# Altium schematic sheet VW.SchDoc
size A3
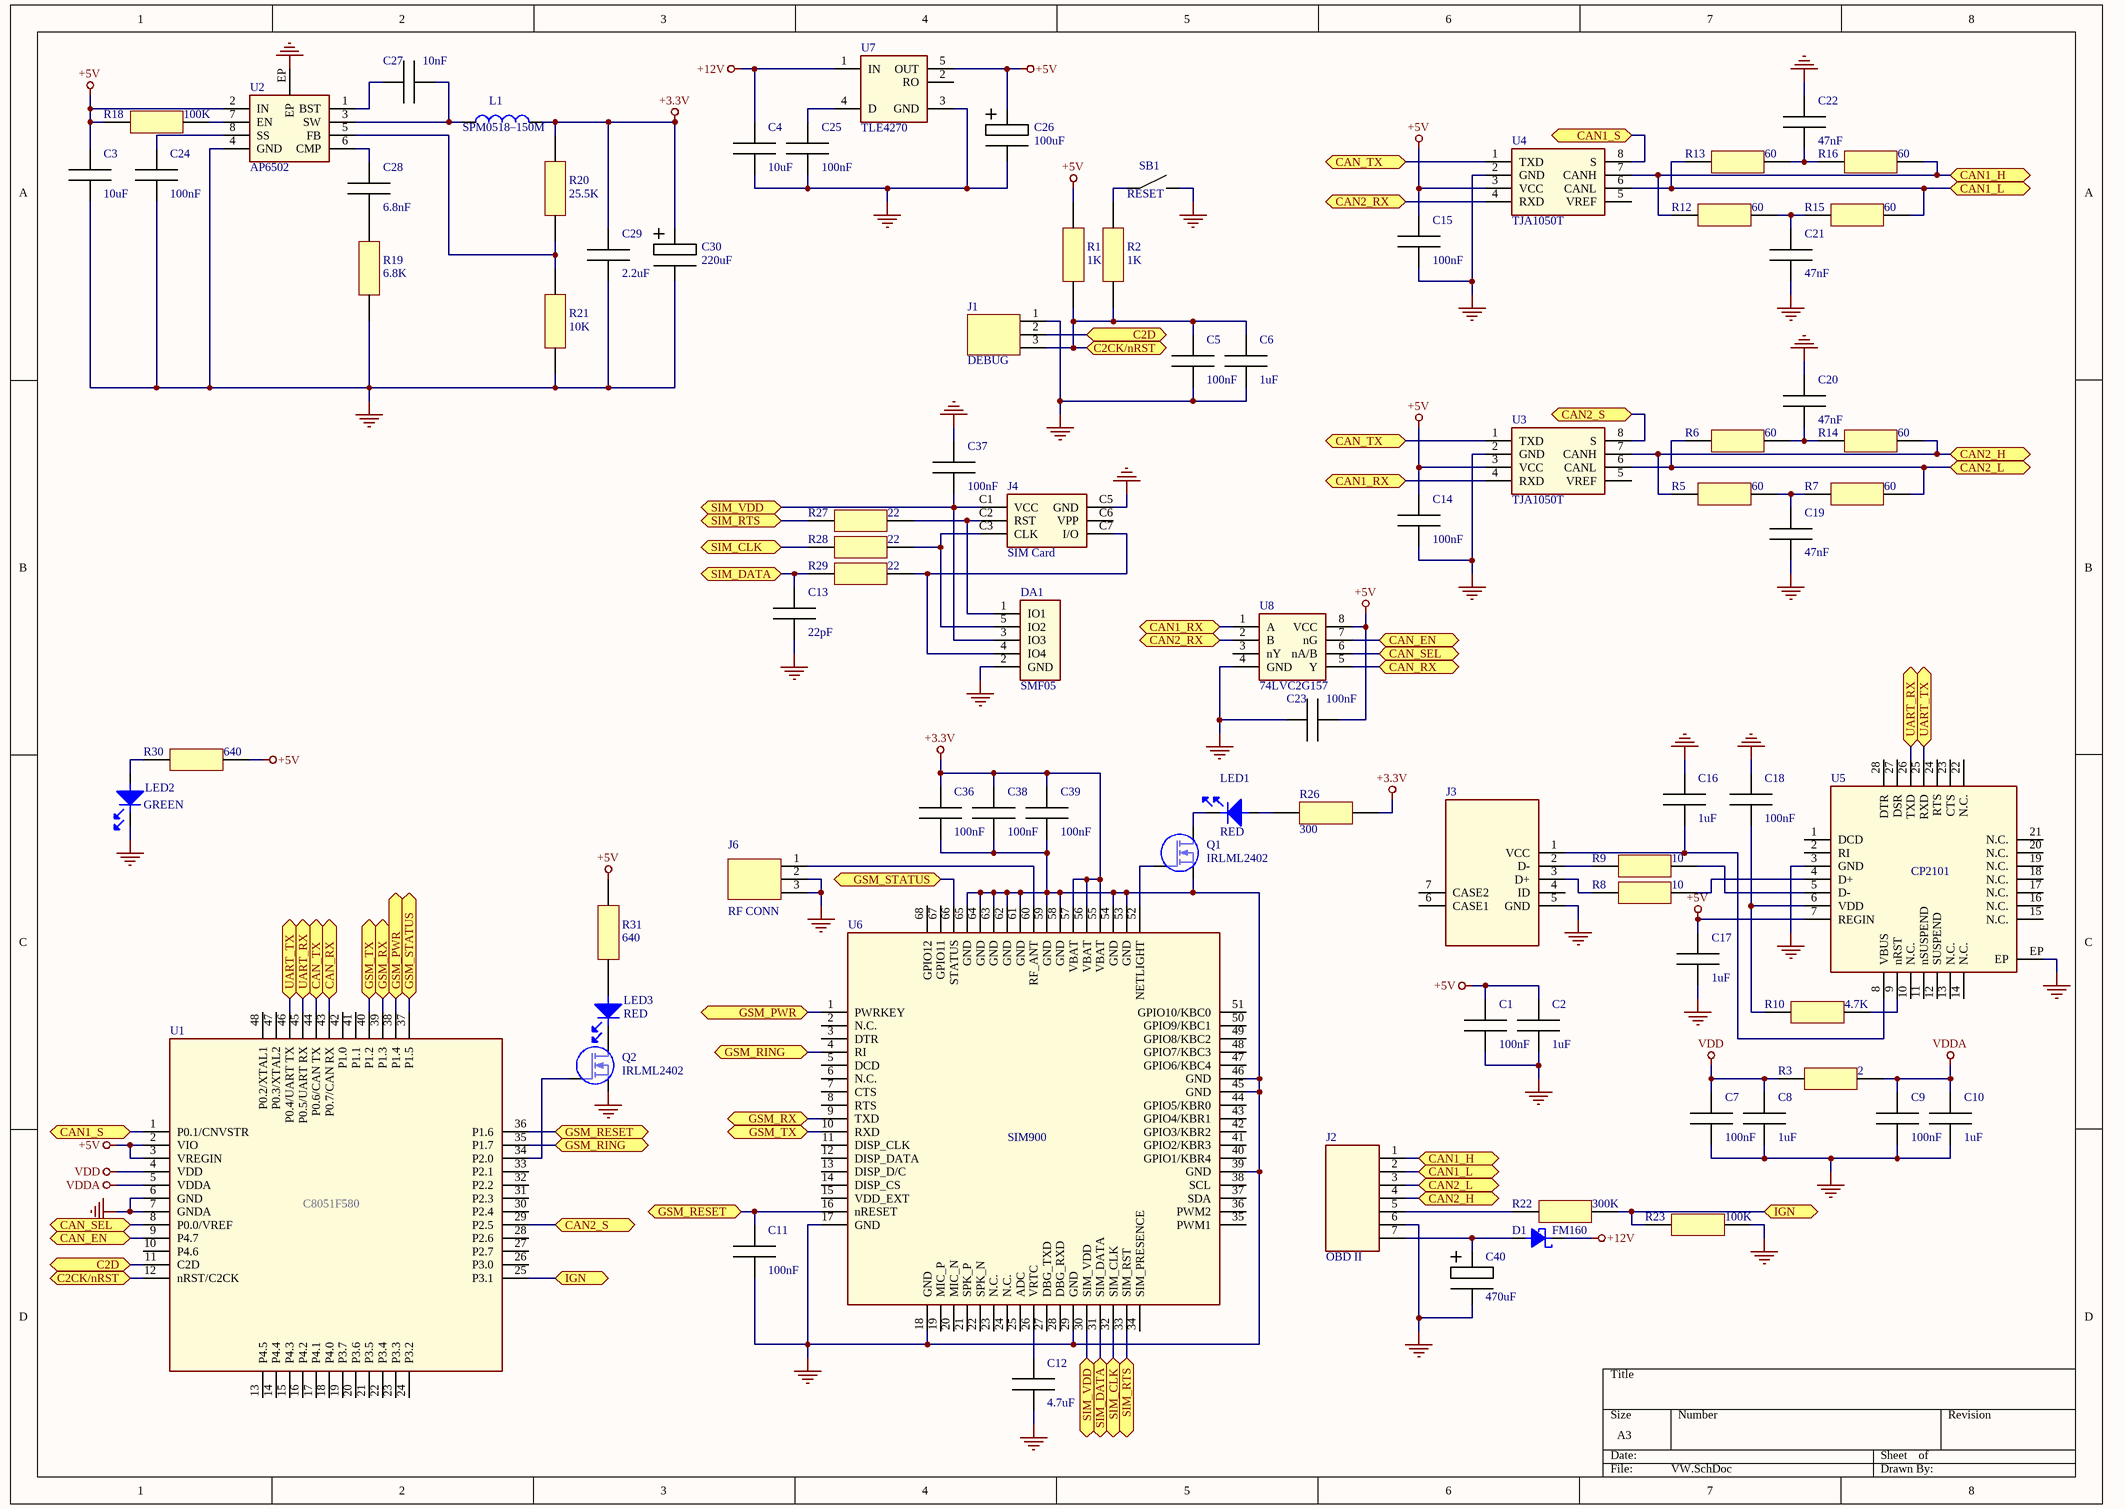
[diagram p0: VW.SchDoc]

## Parts
C1  100nF  [CAPC0805X11N]
C2  1uF  [CAPC0805X11N]
C3  10uF  [CAPC1206X18N]
C4  10uF  [CAPC1206X18N]
C5  100nF  [CAPC0805X11N]
C6  1uF  [CAPC0805X11N]
C7  100nF  [CAPC0805X11N]
C8  1uF  [CAPC0805X11N]
C9  100nF  [CAPC0805X11N]
C10  1uF  [CAPC0805X11N]
C11  100nF  [CAPC0805X11N]
C12  4.7uF  [CAPC0805X11N]
C13  22pF  [CAPC0805X11N]
C14  100nF  [CAPC0805X11N]
C15  100nF  [CAPC0805X11N]
C16  1uF  [CAPC0805X11N]
C17  1uF  [CAPC0805X11N]
C18  100nF  [CAPC0805X11N]
C19  47nF  [CAPC0805X11N]
C20  47nF  [CAPC0805X11N]
C21  47nF  [CAPC0805X11N]
C22  47nF  [CAPC0805X11N]
C23  100nF  [CAPC0805X11N]
C24  100nF  [CAPC0805X11N]
C25  100nF  [CAPC0805X11N]
C26  100uF  [CASE (D) TANT]
C27  10nF  [CAPC0805X11N]
C28  6.8nF  [CAPC0805X11N]
C29  2.2uF  [CAPC0805X11N]
C30  220uF  [CASE (D) TANT]
C36  100nF  [CAPC0805X11N]
C37  100nF  [CAPC0805X11N]
C38  100nF  [CAPC0805X11N]
C39  100nF  [CAPC0805X11N]
C40  470uF  [CASE (D) TANT]
D1  FM160  [SOD323F]
DA1  SMF05  [SOT65P210X110-5N]
J1  DEBUG  [PBS2-3]
J2  OBD II  [PLS-7R]
J3  (no value)  [54819-0519]
J4  SIM Card  [SIM_Card]
J6  RF CONN  [U. FL connector]
L1  SPM0518–150M  [SPM0518]
LED1  RED  [LED]
LED2  GREEN  [LED]
LED3  RED  [LED]
Q1  IRLML2402  [SOT23]
Q2  IRLML2402  [SOT23]
R1  1K  [RESC0805X16N]
R2  1K  [RESC0805X16N]
R3  2  [RESC0805X16N]
R5  60  [RESC0805X16N]
R6  60  [RESC0805X16N]
R7  60  [RESC0805X16N]
R8  10  [RESC0805X16N]
R9  10  [RESC0805X16N]
R10  4.7K  [RESC0805X16N]
R12  60  [RESC0805X16N]
R13  60  [RESC0805X16N]
R14  60  [RESC0805X16N]
R15  60  [RESC0805X16N]
R16  60  [RESC0805X16N]
R18  100K  [RESC0805X16N]
R19  6.8K  [RESC0805X16N]
R20  25.5K  [RESC0805X16N]
R21  10K  [RESC0805X16N]
R22  300K  [RESC0805X16N]
R23  100K  [RESC0805X16N]
R26  300  [RESC0805X16N]
R27  22  [RESC0805X16N]
R28  22  [RESC0805X16N]
R29  22  [RESC0805X16N]
R30  640  [RESC0805X16N]
R31  640  [RESC0805X16N]
SB1  RESET  [SMT_SW6_2MM]
U1  C8051F580  [TSQFP50P900X900X120-48N]
U2  AP6502  [SO-8EP]
U3  TJA1050T  [SOIC127P600X175-8N]
U4  TJA1050T  [SOIC127P600X175-8N]
U5  CP2101  [QFN50P500X500X100_HS-29N]
U6  SIM900  [QFN100P2400X2400X320-68N]
U7  TLE4270  [SOT170P1500X440-6N]
U8  74LVC2G157  [TSSOP50P310X90-8N]

## Ports
C2CK/nRST, C2D, CAN1_H, CAN1_L, CAN1_RX, CAN1_S, CAN2_H, CAN2_L, CAN2_RX, CAN2_S, CAN_EN, CAN_RX, CAN_SEL, CAN_TX, GSM_PWR, GSM_RESET, GSM_RING, GSM_RX, GSM_STATUS, GSM_TX, IGN, SIM_CLK, SIM_DATA, SIM_RTS, SIM_VDD, UART_RX, UART_TX

## Nets
+3.3V: C29.2 C30.2(+) C36.2 C38.2 C39.2 L1.2 R20.1 R26.1 U6.55(VBAT) U6.56(VBAT) U6.57(VBAT)
+5V: C1.2 C2.2 C3.2 C14.2 C15.2 C17.2 C23.2 C26.2(+) R1.2 R18.1 R30.2 R31.1 U1.2(VIO) U1.3(VREGIN) U2.2(IN) U3.3(VCC) U4.3(VCC) U5.7(REGIN) U7.5(OUT) U8.8(VCC)
+12V: C4.2 D1.K U7.1(IN)
GND_POWER: C1.1 C2.1 C3.1 C4.1 C5.1 C6.1 C7.1 C8.1 C9.1 C10.1 C11.1 C12.1 C13.1 C14.1 C15.1 C16.1 C17.1 C18.2 C19.1 C20.2 C21.1 C22.2 C23.1 C24.1 C25.1 C26.1(-) C29.1 C30.1(-) C36.1 C37.2 C38.1 C39.1 C40.1(-) DA1.2(GND) J1.1 J2.6 J3.5(GND) J4.C5(GND) J6.2 J6.3 LED2.2(K) Q1.2(S) Q2.2(S) R19.2 R21.2 R23.1 SB1.2 U1.6(GND) U1.7(GNDA) U2.4(GND) U2.EP U3.2(GND) U4.2(GND) U5.3(GND) U5.EP U6.17(GND) U6.18(GND) U6.29(GND) U6.39(GND) U6.45(GND) U6.46(GND) U6.53(GND) U6.54(GND) U6.58(GND) U6.59(GND) U6.61(GND) U6.62(GND) U6.63(GND) U6.64(GND) U6.65(GND) U7.3(GND) U7.EP U8.4(GND)
VDD: C7.2 C8.2 R3.1 U1.4(VDD)
VDDA: C9.2 C10.2 R3.2 U1.5(VDDA)
C2CK/nRST: C5.2 C6.2 J1.3 R1.1 R2.1 U1.12(nRST/C2CK) ; port C2CK/nRST
C2D: J1.2 U1.11(C2D) ; port C2D
CAN1_H: J2.1 R12.2 R16.1 U4.7(CANH) ; port CAN1_H
CAN1_L: J2.2 R13.2 R15.1 U4.6(CANL) ; port CAN1_L
CAN1_RX: U3.4(RXD) U8.1(A) ; port CAN1_RX
CAN1_S: U1.1(P0.1/CNVSTR) U4.8(S) ; port CAN1_S
CAN2_H: J2.4 R5.2 R14.1 U3.7(CANH) ; port CAN2_H
CAN2_L: J2.3 R6.2 R7.1 U3.6(CANL) ; port CAN2_L
CAN2_RX: U4.4(RXD) U8.2(B) ; port CAN2_RX
CAN2_S: U1.29(P2.5) U3.8(S) ; port CAN2_S
CAN_EN: U1.9(P4.7) U8.7(nG) ; port CAN_EN
CAN_RX: U1.43(P0.7/CAN_RX) U8.5(Y) ; port CAN_RX
CAN_SEL: U1.8(P0.0/VREF) U8.6(nA/B) ; port CAN_SEL
CAN_TX: U1.44(P0.6/CAN_TX) U3.1(TXD) U4.1(TXD) ; port CAN_TX
GSM_PWR: U1.38(P1.4) U6.1(PWRKEY) ; port GSM_PWR
GSM_RESET: C11.2 U1.36(P1.6) U6.16(nRESET) ; port GSM_RESET
GSM_RING: U1.35(P1.7) U6.4(RI) ; port GSM_RING
GSM_RX: U1.39(P1.3) U6.9(TXD) ; port GSM_RX
GSM_STATUS: U1.37(P1.5) U6.66(STATUS) ; port GSM_STATUS
GSM_TX: U1.40(P1.2) U6.10(RXD) ; port GSM_TX
IGN: R22.1 R23.2 U1.25(P3.1) ; port IGN
SIM_CLK: R28.1 U6.32(SIM_CLK) ; port SIM_CLK
SIM_DATA: C13.2 R29.1 U6.31(SIM_DATA) ; port SIM_DATA
SIM_RTS: R27.1 U6.33(SIM_RST) ; port SIM_RTS
SIM_VDD: C37.1 DA1.3(IO3) J4.C1(VCC) U6.30(SIM_VDD) ; port SIM_VDD
UART_RX: U1.45(P0.5/UART_RX) U5.26(TXD) ; port UART_RX
UART_TX: U1.46(P0.4/UART_TX) U5.25(RXD) ; port UART_TX
NetC12_2: C12.2 U6.26(VRTC)
NetC16_2: C16.2 J3.1(VCC) U5.8(VBUS)
NetC18_1: C18.1 R10.1 U5.6(VDD)
NetC19_2: C19.2 R5.1 R7.2
NetC20_1: C20.1 R6.1 R14.2
NetC21_2: C21.2 R12.1 R15.2
NetC22_1: C22.1 R13.1 R16.2
NetC24_2: C24.2 U2.8(SS)
NetC25_2: C25.2 U7.4(D)
NetC27_1: C27.1 L1.1 U2.3(SW)
NetC27_2: C27.2 U2.1(BST)
NetC28_1: C28.1 R19.1
NetC28_2: C28.2 U2.6(CMP)
NetC40_2: C40.2(+) D1.A J2.7
NetDA1_1: DA1.1(IO1) J4.C2(RST) R27.2
NetDA1_4: DA1.4(IO4) J4.C7(I/O) R29.2
NetDA1_5: DA1.5(IO2) J4.C3(CLK) R28.2
NetJ2_5: J2.5 R22.2
NetJ3_2: J3.2(D-) R9.1
NetJ3_3: J3.3(D+) R8.1
NetJ6_1: J6.1 U6.60(RF_ANT)
NetLED1_1: LED1.1(A) R26.2
NetLED1_2: LED1.2(K) Q1.3(D)
NetLED2_1: LED2.1(A) R30.1
NetLED3_1: LED3.1(A) R31.2
NetLED3_2: LED3.2(K) Q2.3(D)
NetQ1_1: Q1.1(G) U6.52(NETLIGHT)
NetQ2_1: Q2.1(G) U1.34(P2.0)
NetR2_2: R2.2 SB1.1
NetR8_2: R8.2 U5.4(D+)
NetR9_2: R9.2 U5.5(D-)
NetR10_2: R10.2 U5.9(nRST)
NetR18_2: R18.2 U2.7(EN)
NetR20_2: R20.2 R21.1 U2.5(FB)

Not connected (* = marked no-connect by the designer): J3 4(ID) 6(CASE1) 7(CASE2); J4 C6(VPP); U1 10(P4.6) 13(P4.5) 14(P4.4) 15(P4.3) 16(P4.2) 17(P4.1) 18(P4.0) 19(P3.7) 20(P3.6) 21(P3.5) 22(P3.4) 23(P3.3) 24(P3.2) 26(P3.0) 27(P2.7) 28(P2.6) 30(P2.4) 31(P2.3) 32(P2.2) 33(P2.1) 41(P1.1) 42(P1.0) 47(P0.3/XTAL2) 48(P0.2/XTAL1); U3 5(VREF); U4 5(VREF); U5 1(DCD) 2(RI) 10(N.C.) 11(nSUSPEND) 12(SUSPEND) 13(N.C.) 14(N.C.) 15(N.C.) 16(N.C.) 17(N.C.) 18(N.C.) 19(N.C.) 20(N.C.) 21(N.C.) 22(N.C.) 23(CTS) 24(RTS) 27(DSR) 28(DTR); U6 2(N.C.) 3(DTR) 5(DCD) 6(N.C.) 7(CTS) 8(RTS) 11(DISP_CLK) 12(DISP_DATA) 13(DISP_D/C) 14(DISP_CS) 15(VDD_EXT) 19(MIC_P) 20(MIC_N) 21(SPK_P) 22(SPK_N) 23(N.C.) 24(N.C.) 25(ADC) 27(DBG_TXD) 28(DBG_RXD) 34(SIM_PRESENCE) 35(PWM1) 36(PWM2) 37(SDA) 38(SCL) 40(GPIO1/KBR4) 41(GPIO2/KBR3) 42(GPIO3/KBR2) 43(GPIO4/KBR1) 44(GPIO5/KBR0) 47(GPIO6/KBC4) 48(GPIO7/KBC3) 49(GPIO8/KBC2) 50(GPIO9/KBC1) 51(GPIO10/KBC0) 67(GPIO11) 68(GPIO12); U7 2(RO); U8 3(nY)

## Library data of the parts
C1 C2 C5-C23 C25 C36-C39 = Capacitor: Voltage: *; OOPTION: *
  C1 C5 C7 C9 C11 C14 C15 C18 C23 C25 C36-C39: Value: 100nF
  C2 C6 C8 C10 C16 C17: Value: 1uF
  C12: Value: 4.7uF
  C13: Value: 22pF
  C19-C22: Value: 47nF
C3 C4 = Capacitor: SMD 1206; Value: 10uF
C24 C27-C29 = Capacitor: SMD 0603
  C24: Value: 100nF
  C27: Value: 10nF
  C28: Value: 6.8nF
  C29: Value: 2.2uF
C26 = Capacitor (elec): Tantalum D Type capacitor; Voltage: 6.3V; Case: *; Value: 100uF
C30 = Capacitor (elec): Tantalum D Type capacitor; Voltage: 16V; Case: *; Value: 220uF
C40 = Capacitor (elec): D-8, h-11.5; Voltage: 16V; Case: *; Value: 470uF
D1 = DIODE SCHOTTKY: OOPTION: *; Value: FM160
J1 = XS-3: OOPTION: *; Value: *
J2 = XP-7: OOPTION: *; Value: OBD II
J3 = miniUSB
J4 = SIM_CARD: Value: SIM Card
J6 = XP-3: OOPTION: *; Value: RF CONN
L1 = INDUCTOR: Value: SPM0518–150M
LED1-LED3 = LED: OOPTION: *
  LED1 LED3: Value: RED
  LED2: Value: GREEN
Q1 Q2 = MOSFET-N: N-Channel MOSFET; Value: IRLML2402
R1-R3 R5-R10 R12-R16 R22 R23 R26 R27 R29-R31 = Res: Tolerance: *; Voltage: *; OOPTION: *
  R1 R2: Value: 1K
  R3: Value: 2
  R5-R7 R12-R16: Value: 60
  R8 R9: Value: 10
  R10: Value: 4.7K
  R22: Value: 300K
  R23: Value: 100K
  R26: Value: 300
  R27 R29: Value: 22
  R30 R31: Value: 640
R18 R19 = Res: SMD 0603; Tolerance: 5%
  R18: Value: 100K
  R19: Value: 6.8K
R20 R21 = Res: SMD 0603; Tolerance: 0.1%
  R20: Value: 25.5K
  R21: Value: 10K
R28 = Res: OOPTION: 123; Tolerance: *; Voltage: *; Value: 22; OOPTION: *
SB1 = Button: Value: RESET; OOPTION: *
U2 = AP6502: DC/DC Converter; OOPTION: *; Value: AP6502
DA1 = SMF05: Value: SMF05
U1 = C8051F580: Value: C8051F580
U3 U4 = TJA1050T: Value: TJA1050T
U5 = CP2101: OOPTION: *; Value: CP2101
U6 = SIM900: Value: SIM900
U7 = TLE4270: Value: TLE4270
U8 = 74LVC2G157: Value: 74LVC2G157